# EAGLE schematic Daughter Card v4 (EAGLE 7.2.0)
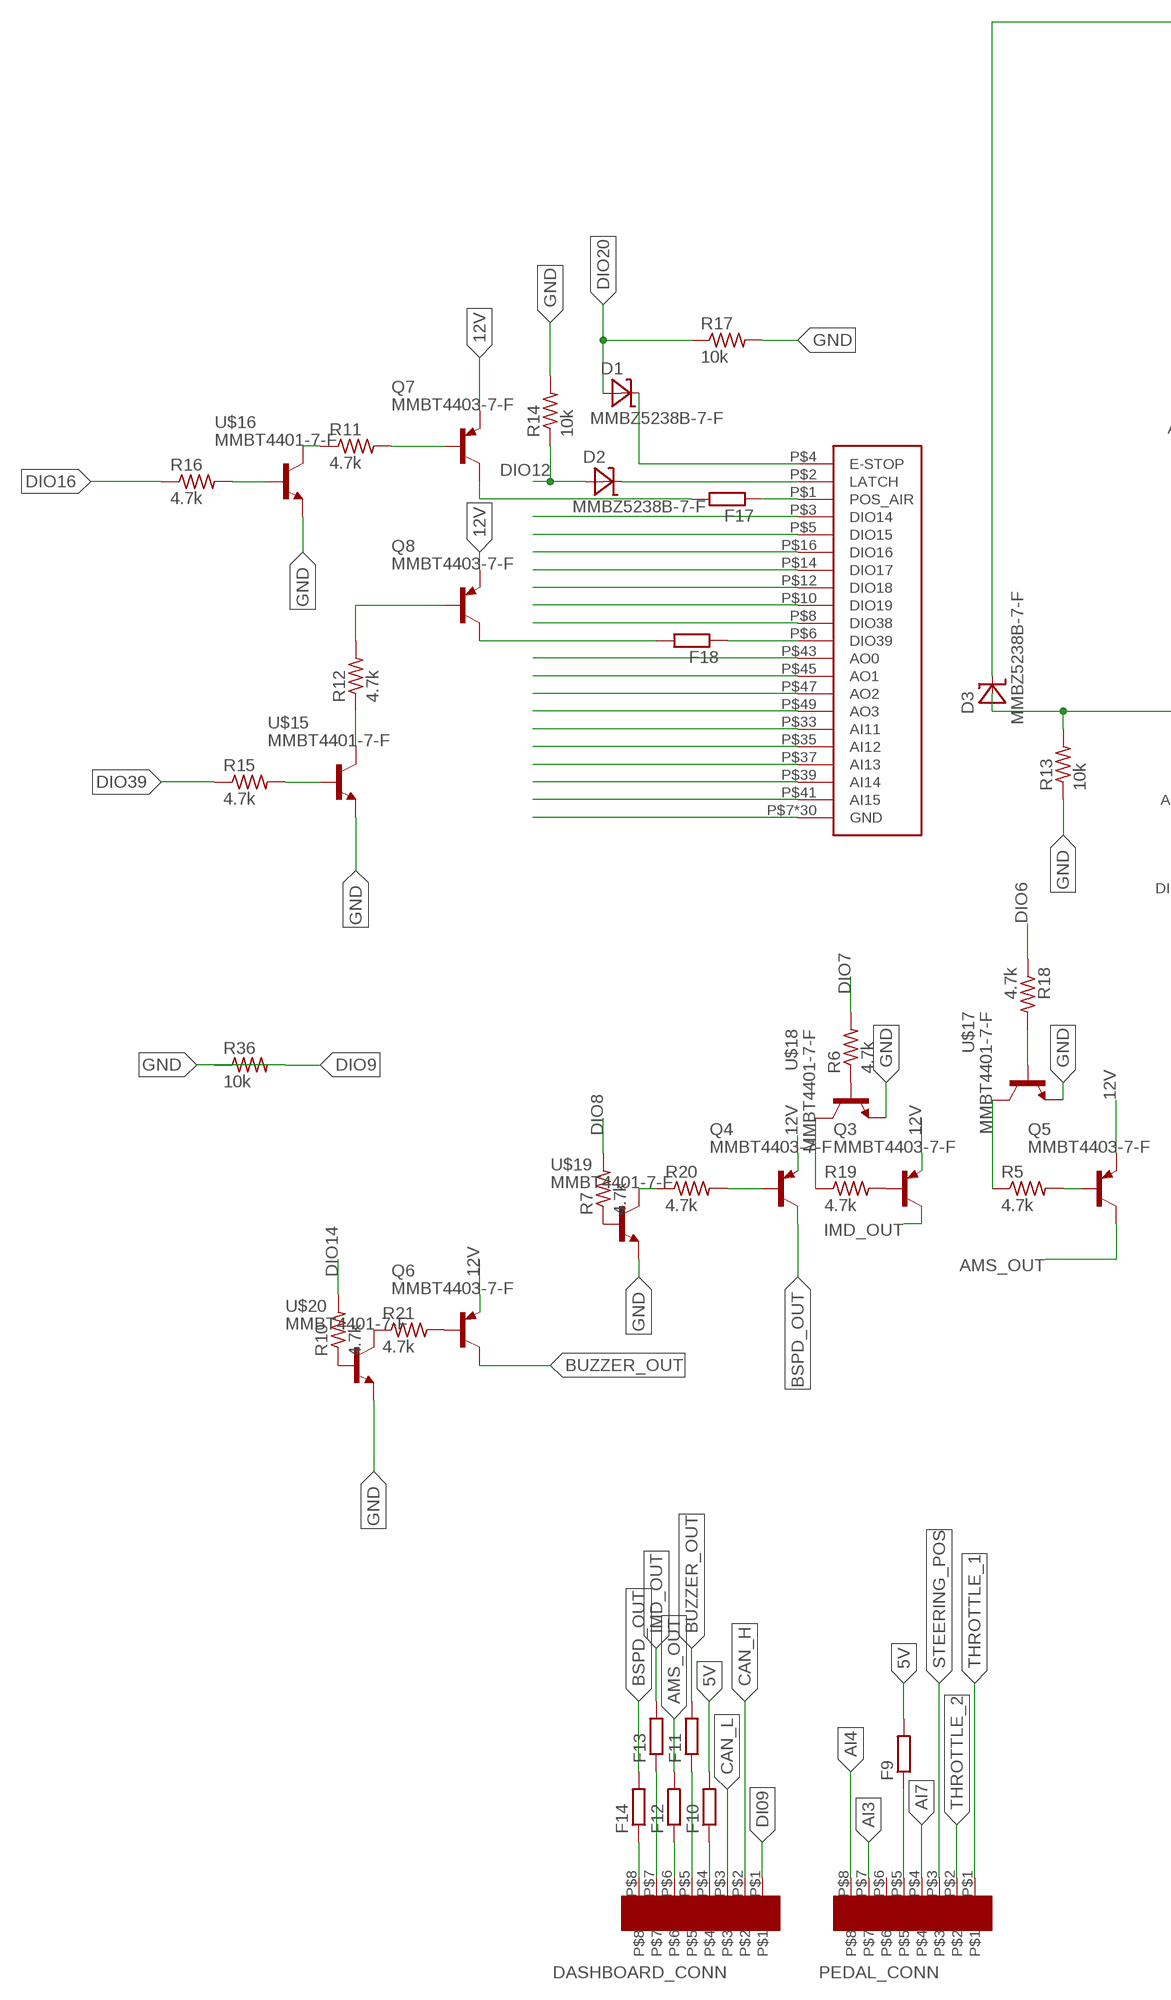
[diagram p0: schematic, sheet 1, part 1 of 2]
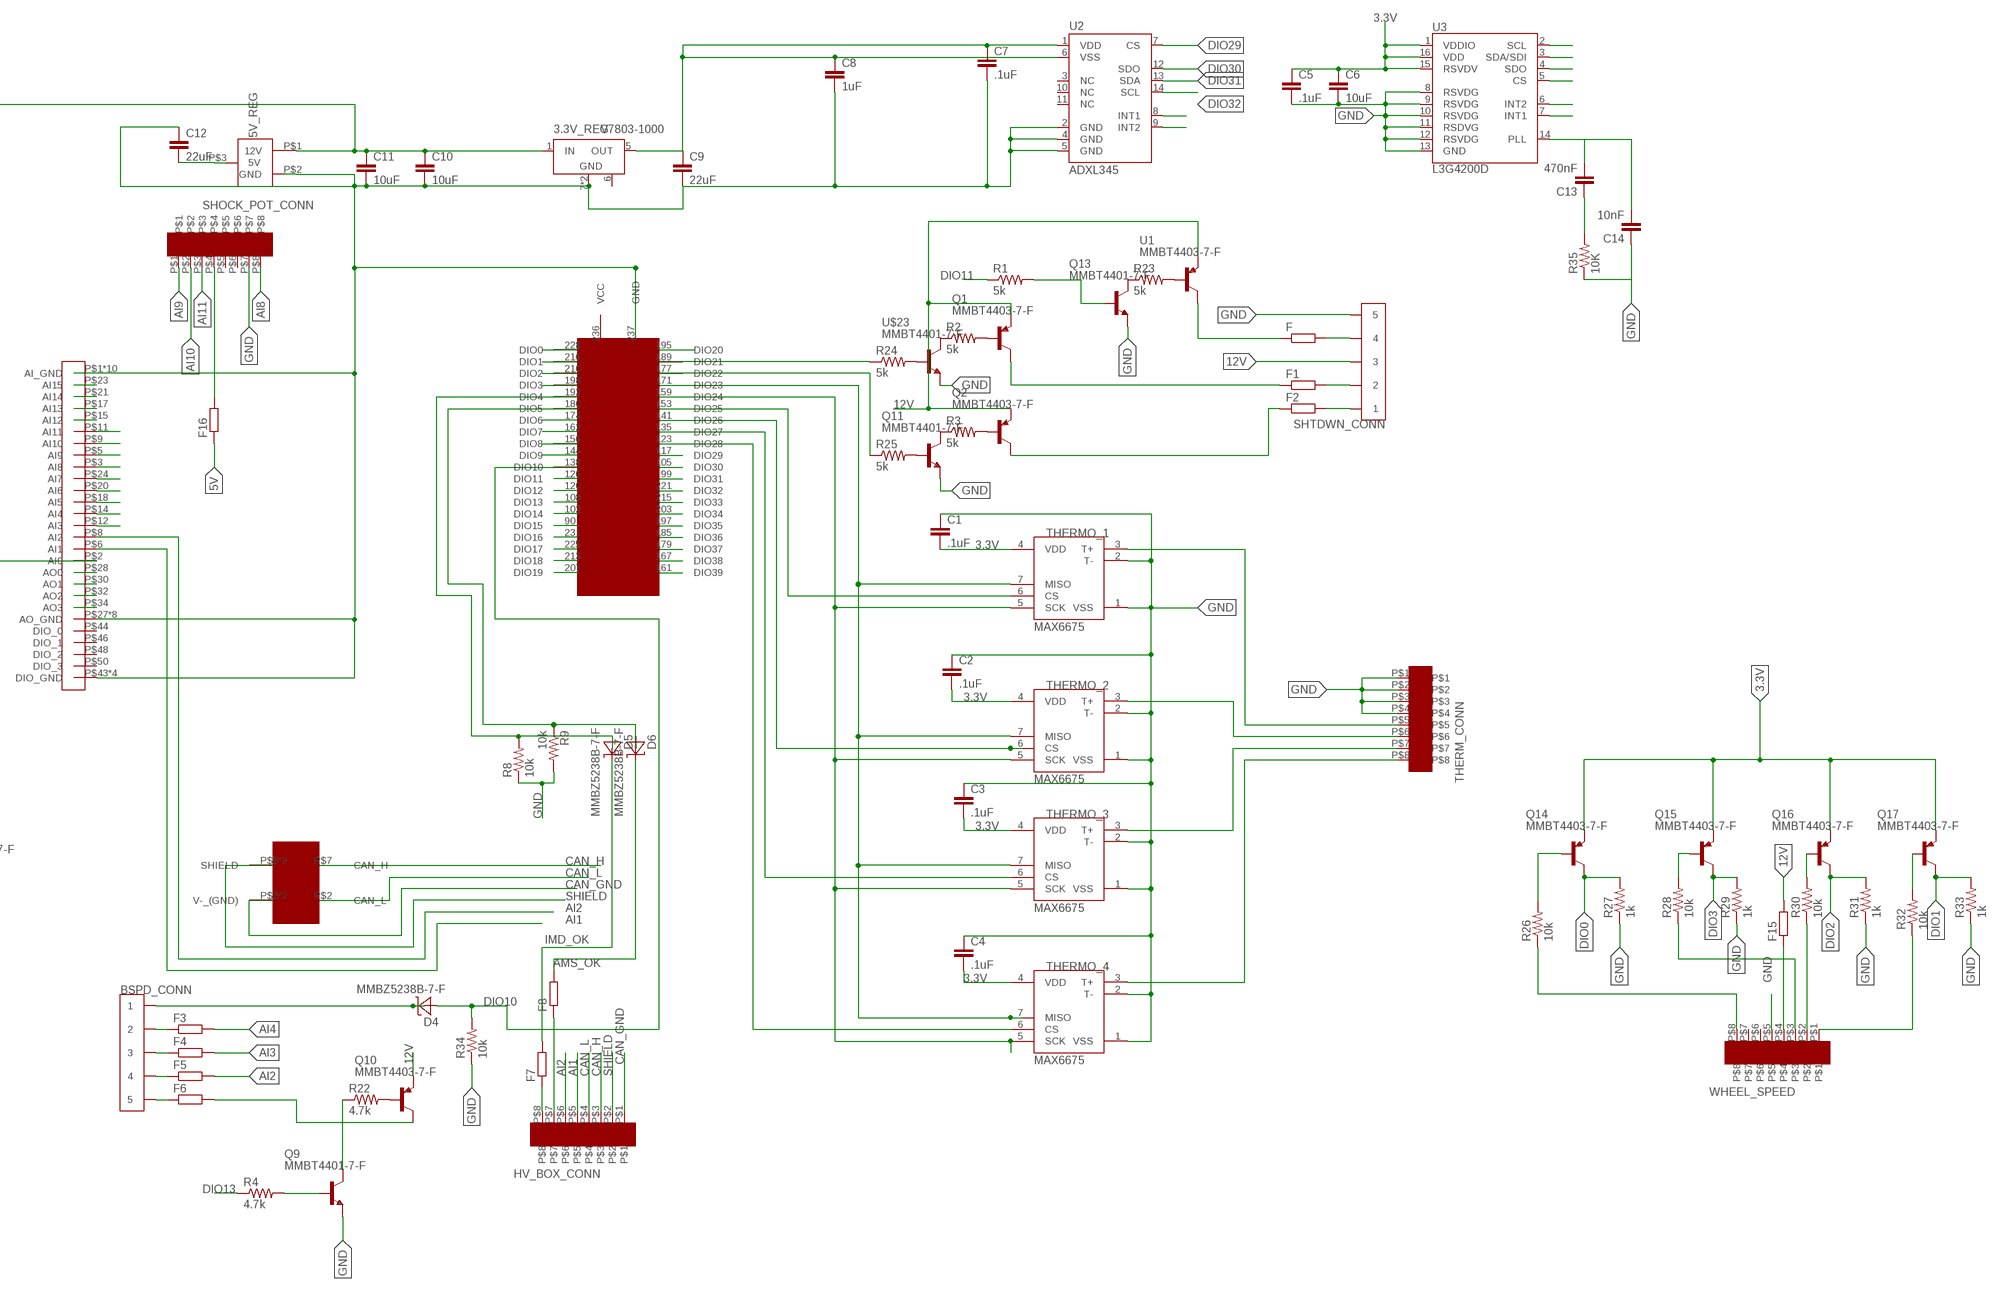
[diagram p1: schematic, sheet 1, part 2 of 2]

## Parts
3.3V_REG  V7803-1000  [V78XX-1000]
5V_REG  V78XX-1500  [V78XX-1500R]
BSPD_CONN  CONN_5  [CONNECTOR_5]
C1  .1uF  CAP0603-CAP  [0603-CAP]
C2  .1uF  CAP0603-CAP  [0603-CAP]
C3  .1uF  CAP0603-CAP  [0603-CAP]
C4  .1uF  CAP0603-CAP  [0603-CAP]
C5  .1uF  CAP0603-CAP  [0603-CAP]
C6  10uF  CAP0603-CAP  [0603-CAP]
C7  .1uF  CAP0603-CAP  [0603-CAP]
C8  1uF  CAP0603-CAP  [0603-CAP]
C9  22uF  CAP0603-CAP  [0603-CAP]
C10  10uF  CAP0603-CAP  [0603-CAP]
C11  10uF  CAP0603-CAP  [0603-CAP]
C12  22uF  CAP0603-CAP  [0603-CAP]
C13  470nF  CAP0603-CAP  [0603-CAP]
C14  10nF  CAP0603-CAP  [0603-CAP]
D1  MMBZ5238B-7-F  [SOT-23-3]
D2  MMBZ5238B-7-F  [SOT-23-3]
D3  MMBZ5238B-7-F  [SOT-23-3]
D4  MMBZ5238B-7-F  [SOT-23-3]
D5  MMBZ5238B-7-F  [SOT-23-3]
D6  MMBZ5238B-7-F  [SOT-23-3]
DASHBOARD_CONN  EN3_PCB_8  [EN3_PCB_8]
F  R-EU_R0402  [R0402]
F1  R-EU_R0402  [R0402]
F2  R-EU_R0402  [R0402]
F3  R-EU_R0402  [R0402]
F4  R-EU_R0402  [R0402]
F5  R-EU_R0402  [R0402]
F6  R-EU_R0402  [R0402]
F7  R-EU_R0402  [R0402]
F8  R-EU_R0402  [R0402]
F9  R-EU_R0402  [R0402]
F10  R-EU_R0402  [R0402]
F11  R-EU_R0402  [R0402]
F12  R-EU_R0402  [R0402]
F13  R-EU_R0402  [R0402]
F14  R-EU_R0402  [R0402]
F15  R-EU_R0402  [R0402]
F16  R-EU_R0402  [R0402]
F17  R-EU_R0402  [R0402]
F18  R-EU_R0402  [R0402]
HV_BOX_CONN  EN3_PCB_8  [EN3_PCB_8]
PEDAL_CONN  EN3_PCB_8  [EN3_PCB_8]
Q1  MMBT4403-7-F  [SOT-23-3]
Q2  MMBT4403-7-F  [SOT-23-3]
Q3  MMBT4403-7-F  [SOT-23-3]
Q4  MMBT4403-7-F  [SOT-23-3]
Q5  MMBT4403-7-F  [SOT-23-3]
Q6  MMBT4403-7-F  [SOT-23-3]
Q7  MMBT4403-7-F  [SOT-23-3]
Q8  MMBT4403-7-F  [SOT-23-3]
Q9  MMBT4401-7-F  [SOT-23-3]
Q10  MMBT4403-7-F  [SOT-23-3]
Q11  MMBT4401-7-F  [SOT-23-3]
Q13  MMBT4401-7-F  [SOT-23-3]
Q14  MMBT4403-7-F  [SOT-23-3]
Q15  MMBT4403-7-F  [SOT-23-3]
Q16  MMBT4403-7-F  [SOT-23-3]
Q17  MMBT4403-7-F  [SOT-23-3]
R1  5k  R-US_R0402  [R0402]
R2  5k  R-US_R0402  [R0402]
R3  5k  R-US_R0402  [R0402]
R4  4.7k  R-US_R0402  [R0402]
R5  4.7k  R-US_R0402  [R0402]
R6  4.7k  R-US_R0402  [R0402]
R7  4.7k  R-US_R0402  [R0402]
R8  10k  R-US_R0402  [R0402]
R9  10k  R-US_R0402  [R0402]
R10  4.7k  R-US_R0402  [R0402]
R11  4.7k  R-US_R0402  [R0402]
R12  4.7k  R-US_R0402  [R0402]
R13  10k  R-US_R0402  [R0402]
R14  10k  R-US_R0402  [R0402]
R15  4.7k  R-US_R0402  [R0402]
R16  4.7k  R-US_R0402  [R0402]
R17  10k  R-US_R0402  [R0402]
R18  4.7k  R-US_R0402  [R0402]
R19  4.7k  R-US_R0402  [R0402]
R20  4.7k  R-US_R0402  [R0402]
R21  4.7k  R-US_R0402  [R0402]
R22  4.7k  R-US_R0402  [R0402]
R23  5k  R-US_R0402  [R0402]
R24  5k  R-US_R0402  [R0402]
R25  5k  R-US_R0402  [R0402]
R26  10k  R-US_R0402  [R0402]
R27  1k  R-US_R0402  [R0402]
R28  10k  R-US_R0402  [R0402]
R29  1k  R-US_R0402  [R0402]
R30  10k  R-US_R0402  [R0402]
R31  1k  R-US_R0402  [R0402]
R32  10k  R-US_R0402  [R0402]
R33  1k  R-US_R0402  [R0402]
R34  10k  R-US_R0402  [R0402]
R35  10K  RESISTOR0603-RES  [0603-RES]
R36  10k  R-US_R0402  [R0402]
SBRIO_ANALOG  SBRIO_MIO  [SBRIO_J502_J503]
SBRIO_AUX  SBRIO_AUX  [SBRIO_J502_J503]
SHOCK_POT_CONN  EN3_PCB_8  [EN3_PCB_8]
SHTDWN_CONN  CONN_5  [CONNECTOR_5]
THERM_CONN  EN3_PCB_8  [EN3_PCB_8]
THERMO_1  MAX6675  [SO08]
THERMO_2  MAX6675  [SO08]
THERMO_3  MAX6675  [SO08]
THERMO_4  MAX6675  [SO08]
U1  MMBT4403-7-F  [SOT-23-3]
U2  ADXL345  [LGA14]
U3  L3G4200D  [LGA16-4X4]
U$2  SBRIO_W500  [SBRIO_W]
U$3  SBRIO_RMC  [SEAM-40-XX.X-XX-06-X-A]
U$15  MMBT4401-7-F  [SOT-23-3]
U$16  MMBT4401-7-F  [SOT-23-3]
U$17  MMBT4401-7-F  [SOT-23-3]
U$18  MMBT4401-7-F  [SOT-23-3]
U$19  MMBT4401-7-F  [SOT-23-3]
U$20  MMBT4401-7-F  [SOT-23-3]
U$23  MMBT4401-7-F  [SOT-23-3]
WHEEL_SPEED  EN3_PCB_8  [EN3_PCB_8]

## Nets
3.3V: 3.3V_REG.5(OUT) C1.2 C2.2 C3.2 C4.2 C5.1 C6.1 C7.1 C8.1 C9.1 Q14.P$3(E) Q15.P$3(E) Q16.P$3(E) Q17.P$3(E) THERMO_1.4(VDD) THERMO_2.4(VDD) THERMO_3.4(VDD) THERMO_4.4(VDD) U2.1(VDD) U2.6(VSS) U3.1(VDDIO) U3.15(RSVDV) U3.16(VDD)
5V: 5V_REG.P$3(5V) C12.2 F9.2 F10.2 F16.1
12V: 3.3V_REG.1(IN) 5V_REG.P$1(12V) C10.1 C11.1 D3.P$1(C) F15.2 Q1.P$3(E) Q2.P$3(E) Q3.P$3(E) Q4.P$3(E) Q5.P$3(E) Q6.P$3(E) Q7.P$3(E) Q8.P$3(E) Q10.P$3(E) SHTDWN_CONN.5 SHTDWN_CONN.6 U1.P$3(E)
AI1: HV_BOX_CONN.P$5 SBRIO_ANALOG.P$6(AI1)
AI2: F5.2 HV_BOX_CONN.P$6 SBRIO_ANALOG.P$8(AI2)
AI3: F4.2 PEDAL_CONN.P$7 SBRIO_ANALOG.P$12(AI3)
AI4: F3.2 PEDAL_CONN.P$8 SBRIO_ANALOG.P$14(AI4)
AI7: PEDAL_CONN.P$4 SBRIO_ANALOG.P$24(AI7)
AI8: SBRIO_ANALOG.P$3(AI8) SHOCK_POT_CONN.P$8
AI9: SBRIO_ANALOG.P$5(AI9) SHOCK_POT_CONN.P$1
AI10: SBRIO_ANALOG.P$9(AI10) SHOCK_POT_CONN.P$2
AI11: SBRIO_ANALOG.P$11(AI11) SBRIO_AUX.P$33(AI11) SHOCK_POT_CONN.P$3
AI12: SBRIO_ANALOG.P$15(AI12) SBRIO_AUX.P$35(AI12)
AI13: SBRIO_ANALOG.P$17(AI13) SBRIO_AUX.P$37(AI13)
AI15: SBRIO_ANALOG.P$23(AI15) SBRIO_AUX.P$41(AI15)
AMS_OK: D6.P$1(C) F8.2
AMS_OUT: F12.2 Q5.P$1(C)
AO0: SBRIO_ANALOG.P$28(AO0) SBRIO_AUX.P$43(AO0)
AO1: SBRIO_ANALOG.P$30(AO1) SBRIO_AUX.P$45(AO1)
AO2: SBRIO_ANALOG.P$32(AO2) SBRIO_AUX.P$47(AO2)
AO3: SBRIO_ANALOG.P$34(AO3) SBRIO_AUX.P$49(AO3)
BSPD_OUT: F14.2 Q4.P$1(C)
BUZZER_OUT: F11.2 Q6.P$1(C)
CAN_GND: HV_BOX_CONN.P$1 U$2.P$3(V-_(GND)) U$2.P$6(V-_(GND))
CAN_H: DASHBOARD_CONN.P$2 HV_BOX_CONN.P$3 U$2.P$7(CAN_H)
CAN_L: DASHBOARD_CONN.P$3 HV_BOX_CONN.P$4 U$2.P$2(CAN_L)
DI09: DASHBOARD_CONN.P$1
DIO0: Q14.P$1(C) R27.2 U$3.228(DIO0)
DIO1: Q17.P$1(C) R33.2 U$3.216(DIO1)
DIO2: Q16.P$1(C) R31.2 U$3.210(DIO2)
DIO3: Q15.P$1(C) R29.2 U$3.198(DIO3)
DIO6: R18.1 U$3.174(DIO6)
DIO7: R6.2 U$3.162(DIO7)
DIO8: R7.2 U$3.156(DIO8)
DIO9: R36.2 U$3.144(DIO9)
DIO10: D4.P$2(A) R34.2 U$3.138(DIO10)
DIO11: R1.1 U$3.126(DIO11)
DIO12: D2.P$2(A) R14.1 U$3.120(DIO12)
DIO13: R4.1 U$3.108(DIO13)
DIO14: R10.2 SBRIO_AUX.P$3(DIO14) U$3.102(DIO14)
DIO15: SBRIO_AUX.P$5(DIO15) U$3.90(DIO15)
DIO16: R16.1 SBRIO_AUX.P$16(DIO16) U$3.231(DIO16)
DIO17: SBRIO_AUX.P$14(DIO17) U$3.225(DIO17)
DIO18: SBRIO_AUX.P$12(DIO18) U$3.213(DIO18)
DIO19: SBRIO_AUX.P$10(DIO19) U$3.207(DIO19)
DIO20: D1.P$2(A) R17.1 U$3.195(DIO20)
DIO29: U2.7(CS) U$3.117(DIO29)
DIO30: U2.12(SDO) U3.4(SDO) U$3.105(DIO30)
DIO31: U2.13(SDA) U3.3(SDA/SDI) U$3.99(DIO31)
DIO32: U2.14(SCL) U3.2(SCL) U$3.221(DIO32)
DIO33: U3.5(CS) U$3.215(DIO33)
DIO34: U3.7(INT1) U$3.203(DIO34)
DIO35: U3.6(INT2) U$3.197(DIO35)
DIO36: U2.8(INT1) U$3.185(DIO36)
DIO37: U2.9(INT2) U$3.179(DIO37)
DIO38: SBRIO_AUX.P$8(DIO38) U$3.167(DIO38)
DIO39: R15.1 U$3.161(DIO39)
GND: 3.3V_REG.7(GND) 3.3V_REG.9(GND) 5V_REG.P$2(GND) C1.1 C2.1 C3.1 C4.1 C5.2 C6.2 C7.2 C8.2 C9.2 C10.2 C11.2 C12.1 C14.1 Q9.P$3(E) Q11.P$3(E) Q13.P$3(E) R8.1 R9.2 R13.1 R14.2 R17.2 R27.1 R29.1 R31.1 R33.1 R34.1 R35.1 R36.1 SBRIO_ANALOG.P$1(AI_GND) SBRIO_ANALOG.P$4(AI_GND) SBRIO_ANALOG.P$7(AI_GND) SBRIO_ANALOG.P$10(AI_GND) SBRIO_ANALOG.P$13(AI_GND) SBRIO_ANALOG.P$16(AI_GND) SBRIO_ANALOG.P$19(AI_GND) SBRIO_ANALOG.P$22(AI_GND) SBRIO_ANALOG.P$25(AI_GND) SBRIO_ANALOG.P$26(AI_GND) SBRIO_ANALOG.P$27(AO_GND) SBRIO_ANALOG.P$29(AO_GND) SBRIO_ANALOG.P$31(AO_GND) SBRIO_ANALOG.P$33(AO_GND) SBRIO_ANALOG.P$35(AO_GND) SBRIO_ANALOG.P$37(AO_GND) SBRIO_ANALOG.P$39(AO_GND) SBRIO_ANALOG.P$41(AO_GND) SBRIO_ANALOG.P$43(DIO_GND) SBRIO_ANALOG.P$45(DIO_GND) SBRIO_ANALOG.P$47(DIO_GND) SBRIO_ANALOG.P$49(DIO_GND) SBRIO_AUX.P$7(GND) SBRIO_AUX.P$9(GND) SBRIO_AUX.P$11(GND) SBRIO_AUX.P$13(GND) SBRIO_AUX.P$15(GND) SBRIO_AUX.P$17(GND) SBRIO_AUX.P$18(GND) SBRIO_AUX.P$19(GND) SBRIO_AUX.P$20(GND) SBRIO_AUX.P$21(GND) SBRIO_AUX.P$22(GND) SBRIO_AUX.P$23(GND) SBRIO_AUX.P$24(GND) SBRIO_AUX.P$25(GND) SBRIO_AUX.P$26(GND) SBRIO_AUX.P$27(GND) SBRIO_AUX.P$28(GND) SBRIO_AUX.P$29(GND) SBRIO_AUX.P$30(GND) SBRIO_AUX.P$31(GND) SBRIO_AUX.P$32(GND) SBRIO_AUX.P$34(GND) SBRIO_AUX.P$36(GND) SBRIO_AUX.P$38(GND) SBRIO_AUX.P$40(GND) SBRIO_AUX.P$42(GND) SBRIO_AUX.P$44(GND) SBRIO_AUX.P$46(GND) SBRIO_AUX.P$48(GND) SBRIO_AUX.P$50(GND) SHOCK_POT_CONN.P$7 SHTDWN_CONN.9 SHTDWN_CONN.10 THERM_CONN.P$1 THERM_CONN.P$2 THERM_CONN.P$3 THERM_CONN.P$4 THERMO_1.1(VSS) THERMO_1.2(T-) THERMO_2.1(VSS) THERMO_2.2(T-) THERMO_3.1(VSS) THERMO_3.2(T-) THERMO_4.1(VSS) THERMO_4.2(T-) U2.2(GND) U2.4(GND) U2.5(GND) U3.8(RSVDG) U3.9(RSVDG) U3.10(RSVDG) U3.11(RSDVG) U3.12(RSVDG) U3.13(GND) U$3.237(GND) U$15.P$3(E) U$16.P$3(E) U$17.P$3(E) U$18.P$3(E) U$19.P$3(E) U$20.P$3(E) U$23.P$3(E) WHEEL_SPEED.P$5
IMD_OK: D5.P$1(C) F7.2
IMD_OUT: F13.2 Q3.P$1(C)
N$1: D2.P$1(C) SBRIO_AUX.P$2(LATCH)
N$2: D1.P$1(C) SBRIO_AUX.P$4(E-STOP)
N$3: R32.1 WHEEL_SPEED.P$1
N$4: D3.P$2(A) R13.2 SBRIO_ANALOG.P$2(AI0)
N$5: Q6.P$2(B) R21.2
N$6: Q16.P$2(B) R30.2
N$7: F1.1 Q1.P$1(C)
N$8: F2.1 Q2.P$1(C)
N$9: R28.1 WHEEL_SPEED.P$3
N$10: R26.1 WHEEL_SPEED.P$8
N$11: R24.1 U$3.189(DIO21)
N$12: R25.1 U$3.177(DIO22)
N$13: F8.1 HV_BOX_CONN.P$7
N$14: F7.1 HV_BOX_CONN.P$8
N$15: D5.P$2(A) R8.2 U$3.192(DIO4)
N$16: D6.P$2(A) R9.1 U$3.180(DIO5)
N$17: THERMO_1.7(MISO) THERMO_2.7(MISO) THERMO_3.7(MISO) THERMO_4.7(MISO) U$3.171(DIO23)
N$18: THERMO_1.5(SCK) THERMO_2.5(SCK) THERMO_3.5(SCK) THERMO_4.5(SCK) U$3.159(DIO24)
N$20: F16.2 SHOCK_POT_CONN.P$4
N$21: F15.1 WHEEL_SPEED.P$4
N$22: F9.1 PEDAL_CONN.P$5
N$23: DASHBOARD_CONN.P$4 F10.1
N$24: DASHBOARD_CONN.P$5 F11.1
N$25: THERMO_1.6(CS) U$3.153(DIO25)
N$26: THERMO_2.6(CS) U$3.141(DIO26)
N$27: THERMO_3.6(CS) U$3.135(DIO27)
N$28: THERMO_4.6(CS) U$3.123(DIO28)
N$29: THERM_CONN.P$5 THERMO_1.3(T+)
N$30: THERM_CONN.P$6 THERMO_2.3(T+)
N$31: THERM_CONN.P$7 THERMO_3.3(T+)
N$32: THERM_CONN.P$8 THERMO_4.3(T+)
N$33: DASHBOARD_CONN.P$6 F12.1
N$34: DASHBOARD_CONN.P$7 F13.1
N$35: DASHBOARD_CONN.P$8 F14.1
N$36: F.2 SHTDWN_CONN.7 SHTDWN_CONN.8
N$37: C13.2 C14.2 U3.14(PLL)
N$38: C13.1 R35.2
N$39: F1.2 SHTDWN_CONN.3 SHTDWN_CONN.4
N$40: F2.2 SHTDWN_CONN.1 SHTDWN_CONN.2
N$41: BSPD_CONN.9 BSPD_CONN.10 F6.1
N$42: BSPD_CONN.1 BSPD_CONN.2 D4.P$1(C)
N$43: BSPD_CONN.7 BSPD_CONN.8 F5.1
N$44: F.1 U1.P$1(C)
N$45: F6.2 Q10.P$1(C)
N$46: R23.2 U1.P$2(B)
N$47: Q1.P$2(B) R2.2
N$48: Q2.P$2(B) R3.2
N$49: Q10.P$2(B) R22.2
N$50: Q5.P$2(B) R5.2
N$51: Q3.P$2(B) R19.2
N$52: BSPD_CONN.5 BSPD_CONN.6 F4.1
N$53: BSPD_CONN.3 BSPD_CONN.4 F3.1
N$54: Q7.P$2(B) R11.2
N$55: F17.1 SBRIO_AUX.P$1(POS_AIR)
N$56: F17.2 Q7.P$1(C)
N$57: F18.2 Q8.P$1(C)
N$58: Q8.P$2(B) R12.2
N$59: F18.1 SBRIO_AUX.P$6(DIO39)
N$60: R15.2 U$15.P$2(B)
N$61: R12.1 U$15.P$1(C)
N$62: R16.2 U$16.P$2(B)
N$63: R11.1 U$16.P$1(C)
N$64: R5.1 U$17.P$1(C)
N$65: R18.2 U$17.P$2(B)
N$66: R19.1 U$18.P$1(C)
N$67: R6.1 U$18.P$2(B)
N$68: Q4.P$2(B) R20.2
N$69: R20.1 U$19.P$1(C)
N$70: R7.1 U$19.P$2(B)
N$71: R21.1 U$20.P$1(C)
N$72: R10.1 U$20.P$2(B)
N$73: Q9.P$1(C) R22.1
N$74: Q9.P$2(B) R4.2
N$75: Q13.P$1(C) R23.1
N$76: Q13.P$2(B) R1.2
N$77: R2.1 U$23.P$1(C)
N$78: Q11.P$1(C) R3.1
N$79: R24.2 U$23.P$2(B)
N$80: Q11.P$2(B) R25.2
N$81: Q14.P$2(B) R26.2
N$82: Q15.P$2(B) R28.2
N$83: R30.1 WHEEL_SPEED.P$2
N$84: Q17.P$2(B) R32.2
SHIELD: HV_BOX_CONN.P$2 U$2.P$5(SHIELD) U$2.P$10(SHIELD)
STEERING_POS: PEDAL_CONN.P$3 SBRIO_ANALOG.P$21(AI14) SBRIO_AUX.P$39(AI14)
THROTTLE_1: PEDAL_CONN.P$1 SBRIO_ANALOG.P$18(AI5)
THROTTLE_2: PEDAL_CONN.P$2 SBRIO_ANALOG.P$20(AI6)
Unconnected: 3.3V_REG.6 PEDAL_CONN.P$6 SBRIO_ANALOG.P$44(DIO_0) SBRIO_ANALOG.P$46(DIO_1) SBRIO_ANALOG.P$48(DIO_2) SBRIO_ANALOG.P$50(DIO_3) SHOCK_POT_CONN.P$5 SHOCK_POT_CONN.P$6 U2.3(NC) U2.10(NC) U2.11(NC) WHEEL_SPEED.P$6 WHEEL_SPEED.P$7

## Power pins joined to a net without a drawn wire
VCC: U$3.236(VCC)

## Library data of the parts
3.3V_REG = formula electric:V7803-1000
5V_REG = formula electric:V78XX-1500
BSPD_CONN SHTDWN_CONN = formula electric:CONN_5
C1-C14 = SparkFun-Passives:CAP: Capacitor Standard 0603 ceramic capacitor, and 0.1" leaded capacitor.
D1-D6 = formula electric:MMBZ5238B-7-F: Digikey: MMBZ5238B-FDICT-ND
DASHBOARD_CONN HV_BOX_CONN PEDAL_CONN SHOCK_POT_CONN THERM_CONN WHEEL_SPEED = formula electric:EN3_PCB_8
F F1-F18 = resistor:R-EU_: RESISTOR, European symbol
Q1-Q8 Q10 Q14-Q17 U1 = formula electric:MMBT4403-7-F
Q9 Q11 Q13 U$15-U$20 U$23 = formula electric:MMBT4401-7-F
R1-R34 R36 = resistor:R-US_: RESISTOR, American symbol
R35 = SparkFun-Passives:RESISTOR: Resistor Basic schematic elements and footprints for 0603, 1206, and PTH resistors.
SBRIO_ANALOG = formula electric:SBRIO_MIO
SBRIO_AUX = formula electric:SBRIO_AUX: An output for a lot of the extra pins on the sbRIO.
THERMO_1-THERMO_4 = max6675:MAX6675
U2 = SparkFun-Sensors:ADXL345: 3-axis SPI/I2C 2/4/8/16g accelerometer
U3 = SparkFun-Sensors:L3G4200D: L3G4200D Three-axis, digital output gyroscope The L3G4200D is a low-power three-axis angular rate sensor, has a full scale of ±250/±500/±2000 dps and is capable of measuring rates with a user-selectable bandwidth. It includes a sensing element and an IC interface capable of providing the measured angular rate to the external world through a digital interface (I2C/SPI). Package: 4x4x1.1 LGA-16 (LGA16-4x4.PAC)
U$2 = formula electric:SBRIO_W500
U$3 = SEAM-40-XX.X-XX-06-X-A:SBRIO_RMC

## Net classes
0 default: clearance 0.205 mm